# Altium schematic sheet USB_to_UART.SchDoc: USB_to_UART_and_Power_Supply
size 431 x 279 mm; Engineer: Will Mensah; Organization: ORGANIZATION; Address1: ADDRESS 1; Address2: ADDRESS 2; Address3: ADDRESS 3; Address4: ADDRESS 4; Revision: -; SheetNumber: 1; SheetTotal: 6; ENG_APP_DATE: --/--/--; DSN_APP_DATE: --/--/--; CHK_APP_DATE: --/--/--
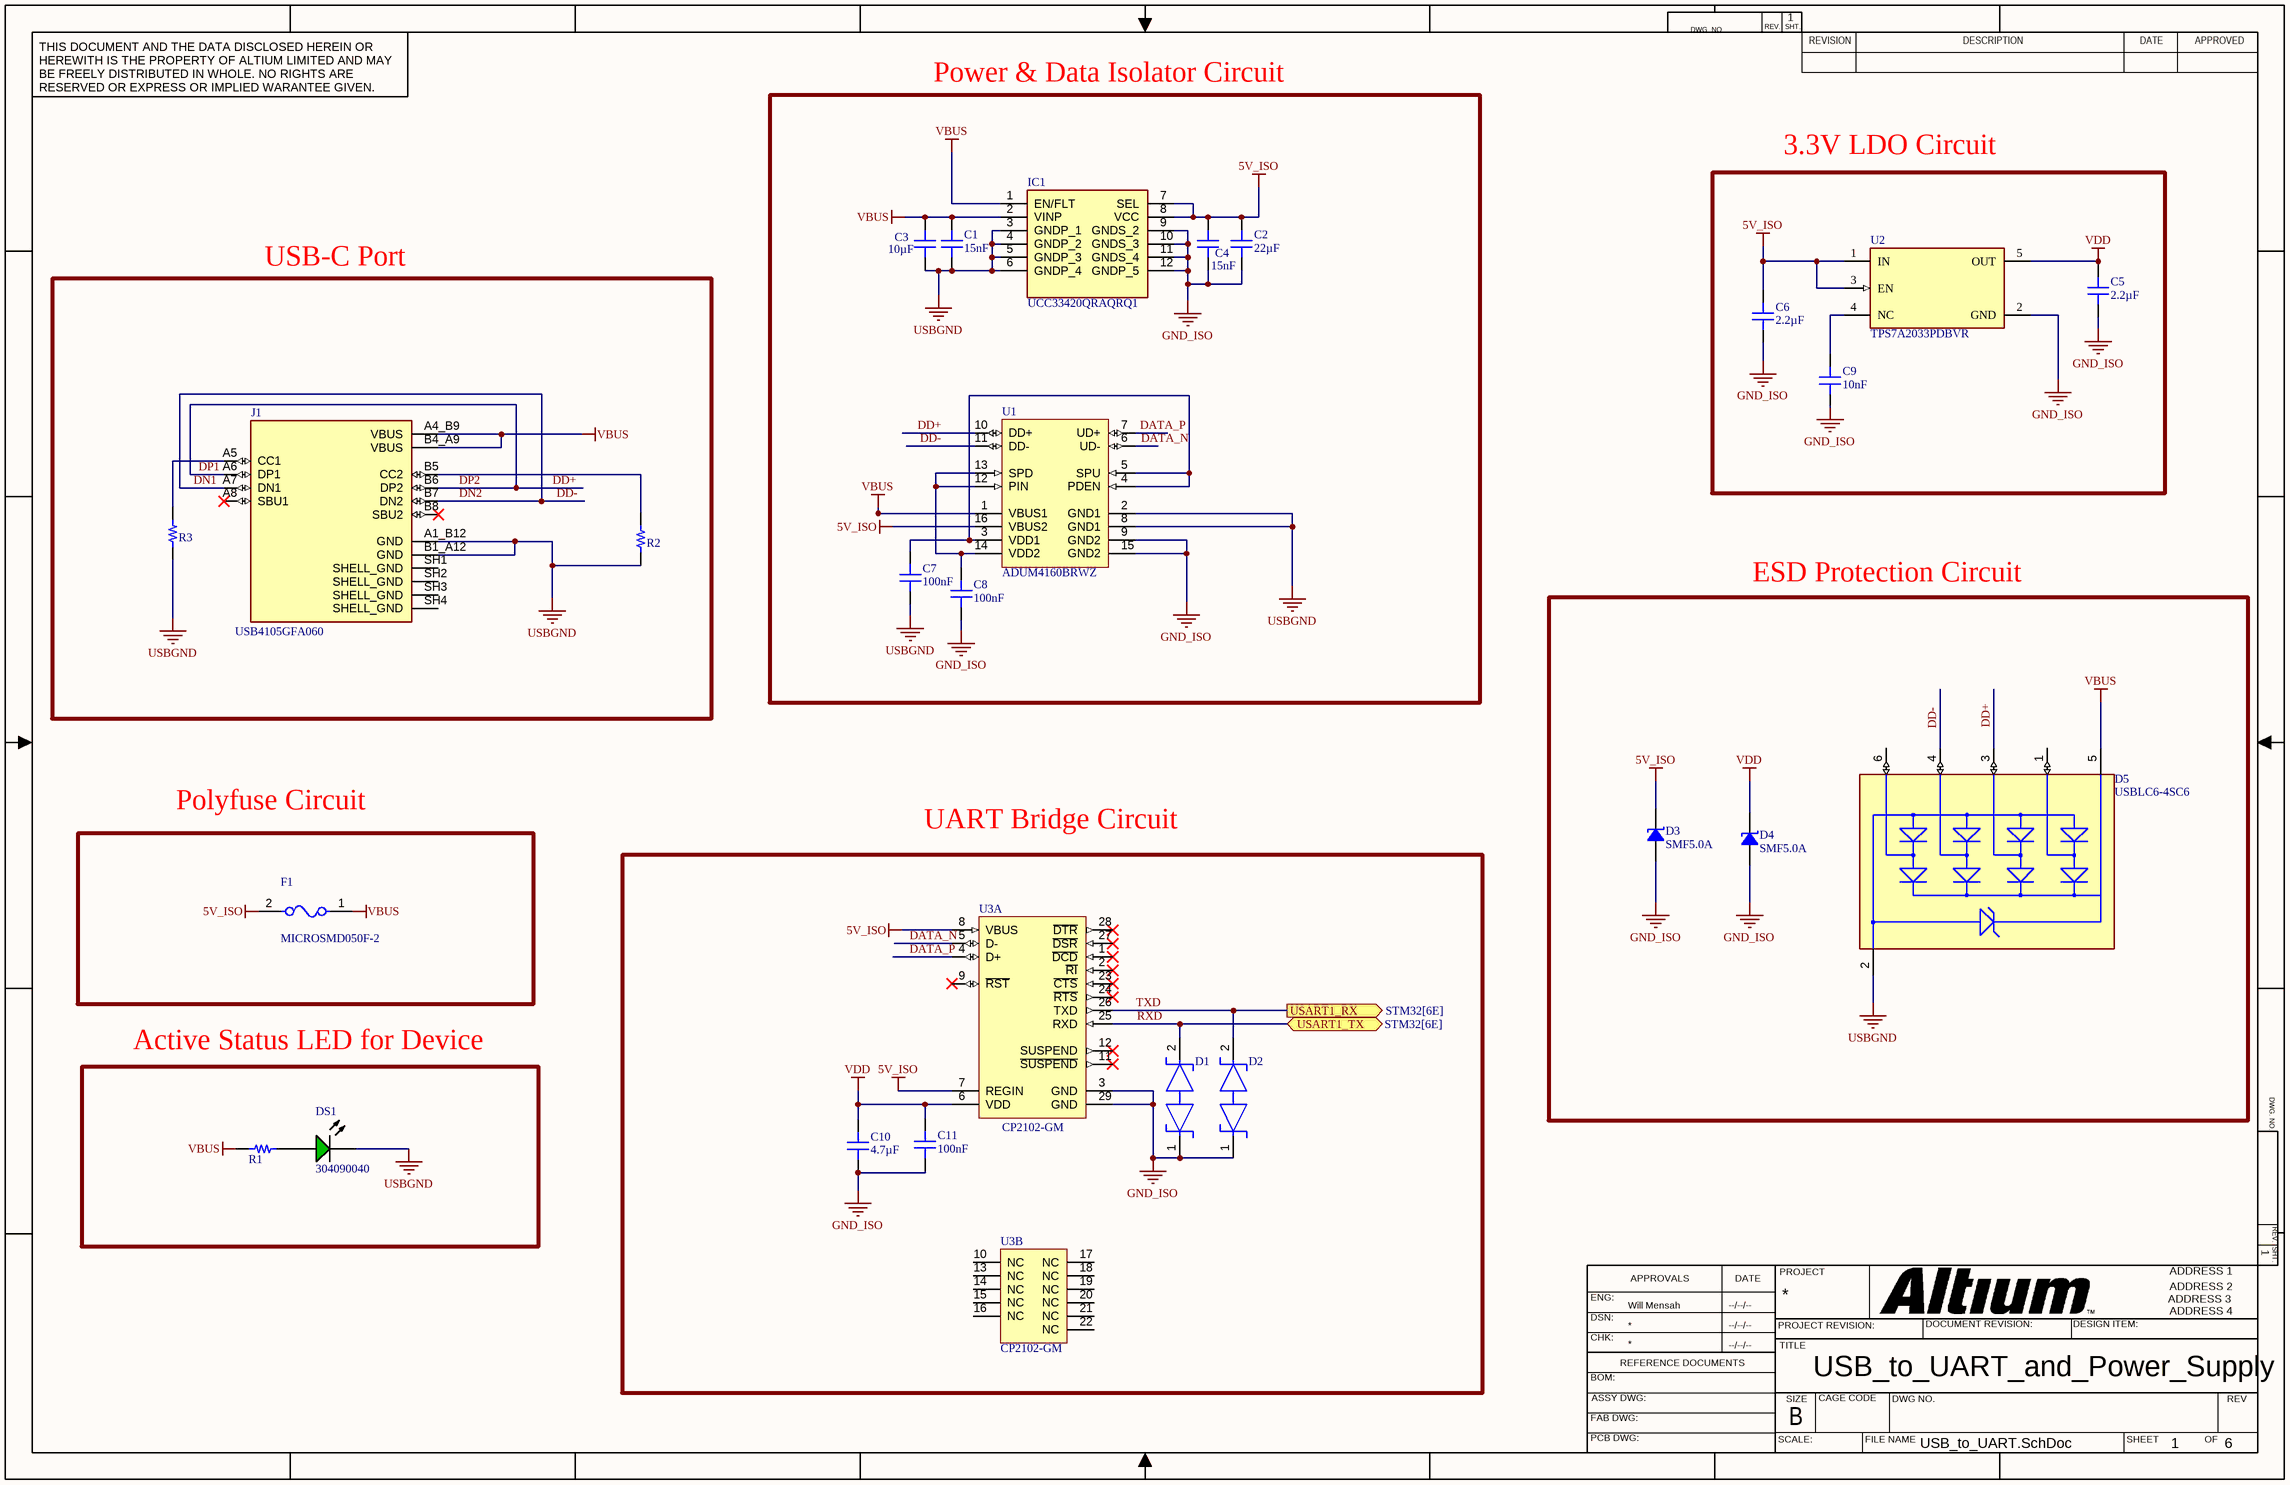
[diagram p0: USB_to_UART.SchDoc]

## Parts
C1  value 15nF  [CAP 1206_3216 - 0.8MM]  (hidden comment: 885342208013)
C2  value 22µF  [MURATA - GRM32E]  (hidden comment: GRM32ER71E226ME15L)
C3  value 10µF  [MURATA - GRM32E]  (hidden comment: GRM32ER71H106MA12L)
C4  value 15nF  [CAP 1206_3216 - 0.8MM]  (hidden comment: 885342208013)
C5  value 2.2µF  [MURATA CAP GCM31M 1206_3216]  (hidden comment: GCM31CL8EL225KE07L)
C6  value 2.2µF  [MURATA CAP GCM31M 1206_3216]  (hidden comment: GCM31CL8EL225KE07L)
C7  value 100nF  [MURATA CAP GCM31M 1206_3216]  (hidden comment: GCM31C5C1H104FA16L)
C8  value 100nF  [MURATA CAP GCM31M 1206_3216]  (hidden comment: GCM31C5C1H104FA16L)
C9  value 10nF  [MURATA CAP GRM31B 1206_3216]  (hidden comment: GRM31B7U2E103JW31L)
C10  value 4.7µF  [MURATA GRM21B 0805_2012]  (hidden comment: GRM21BR71A475KE51L)
C11  value 100nF  [MURATA CAP GCM31M 1206_3216]  (hidden comment: GCM31C5C1H104FA16L)
D1  TPD1E10B06DPYR  [FP-DPY0002A-MFG]  (value not drawn)
D2  TPD1E10B06DPYR  [FP-DPY0002A-MFG]  (value not drawn)
D3  SMF5.0A  [SOD123F]
D4  SMF5.0A  [SOD123F]
D5  USBLC6-4SC6  [FP-SOT23-6L-MFG]
DS1  304090040  [LED-2P-2.28-3MM]
F1  MICROSMD050F-2  [FP-microSMD-MFG]
IC1  UCC33420QRAQRQ1  [UCC33020QRAQRQ1]
J1  USB4105GFA060  [GCT_USB4105GFA060]
R1  RC1206FR-101KL  [YAGEO RES 1206_3216]  (value not drawn)
R2  RP1206BRD075K1L  [YAGEO RES 1206_3216]  (value not drawn)
R3  RP1206BRD075K1L  [YAGEO RES 1206_3216]  (value not drawn)
U1  ADUM4160BRWZ  [RW-16_L]
U2  TPS7A2033PDBVR  [FP-DBV0005A-MFG]
U3  CP2102-GM  [SLAB-QFN-28-3125x3125TP_N]  (parts A,B of 2)

## Blocks framed on the sheet
Power & Data Isolator Circuit: C1-C4 C7 C8 IC1 U1
3.3V LDO Circuit: C5 C6 C9 U2
USB-C Port: J1 R2 R3
ESD Protection Circuit: D3-D5
Polyfuse Circuit: F1
UART Bridge Circuit: C10 C11 D1 D2 U3
Active Status LED for Device: DS1 R1

## Ports
USART1_RX (out, see STM32[6E]), USART1_TX (bidir, see STM32[6E])

## Nets
5V_ISO: C2.2 C4.2 C6.2 D3.2 F1.2 IC1.7(SEL) IC1.8(VCC) U1.16(VBUS2) U2.1(IN) U2.3(EN) U3.7(REGIN) U3.8(VBUS)
GND_ISO: C2.1 C4.1 C5.1 C6.1 C8.1 C9.1 C10.1 C11.1 D1.1 D2.1 D3.1 D4.1 IC1.9(GNDS_2) IC1.10(GNDS_3) IC1.11(GNDS_4) IC1.12(GNDP_5) U1.9(GND2) U1.15(GND2) U2.2(GND) U3.3(GND) U3.29(GND)
USBGND: C1.1 C3.1 C7.1 D5.2(GND) DS1.2(K) IC1.3(GNDP_1) IC1.4(GNDP_2) IC1.5(GNDP_3) IC1.6(GNDP_4) J1.A1_B12(GND) J1.B1_A12(GND) R2.1 R3.2 U1.2(GND1) U1.8(GND1)
VBUS: C1.2 C3.2 D5.5(VBUS) F1.1 IC1.1(EN/FLT) IC1.2(VINP) J1.A4_B9(VBUS) J1.B4_A9(VBUS) R1.2 U1.1(VBUS1)
VDD: C5.2 C10.2 C11.2 D4.2 U2.5(OUT) U3.6(VDD)
DATA_N: U1.6(UD-) U3.5(D-)
DATA_P: U1.7(UD+) U3.4(D+)
DD+: D5.3(I/O2) J1.A6(DP1) J1.B6(DP2) U1.10(DD+)  [also labelled DP1, DP2]
DD-: D5.4(I/O3) J1.A7(DN1) J1.B7(DN2) U1.11(DD-)  [also labelled DN1, DN2]
RXD: D1.2 U3.25(RXD) ; port USART1_TX
TXD: D2.2 U3.26(TXD) ; port USART1_RX
NetC7_2: C7.2 U1.3(VDD1) U1.4(PDEN) U1.5(SPU)
NetC8_2: C8.2 U1.12(PIN) U1.13(SPD) U1.14(VDD2)
NetC9_2: C9.2 U2.4(NC)
NetDS1_1: DS1.1(A) R1.1
NetJ1_A5: J1.A5(CC1) R3.1
NetJ1_B5: J1.B5(CC2) R2.2

Not connected (* = marked no-connect by the designer): D5 1(I/O1) 6(I/O4); J1 A8(SBU1)* B8(SBU2)* SH1(SHELL_GND) SH2(SHELL_GND) SH3(SHELL_GND) SH4(SHELL_GND); U3 1(~{DCD})* 2(~{RI})* 9(~{RST})* 10(NC) 11(~{SUSPEND})* 12(SUSPEND)* 13(NC) 14(NC) 15(NC) 16(NC) 17(NC) 18(NC) 19(NC) 20(NC) 21(NC) 22(NC) 23(~{CTS})* 24(~{RTS})* 27(~{DSR})* 28(~{DTR})*

## Notes on the sheet
- DWG. NO.
- REV.
- SHT.
- THIS DOCUMENT AND THE DATA DISCLOSED HEREIN OR HEREWITH IS THE PROPERTY OF ALTIUM LIMITED AND MAY BE FREELY DISTRIBUTED IN WHOLE. NO RIGHTS ARE RESERVED OR EXPRESS OR IMPLIED WARANTEE GIVEN.
- REVISION
- DESCRIPTION
- DATE
- APPROVED
- ENG:
- APPROVALS
- PROJECT
- DSN:
- CHK:
- REFERENCE DOCUMENTS
- PROJECT REVISION:
- TITLE
- DOCUMENT REVISION:
- DESIGN ITEM:
- BOM:
- FAB DWG:
- PCB DWG:
- ASSY DWG:
- SCALE:
- SIZE
- B
- CAGE CODE
- FILE NAME
- DWG NO.
- SHEET
- OF
- REV

## Library data of the parts
C1 C4 = CMP-001-059796-1: CAP CER 15000PF 630V X7R 1206; Part Number: 885342208013
C2 = CMP-001-068110-1: CAP CER 22UF 25V X7R 1210; Part Number: GRM32ER71E226ME15L
C3 = CMP-001-068673-1: CAP CER 10UF 50V X7R 1210; Part Number: GRM32ER71H106MA12L
C5 C6 = CMP-001-063237-1: CAP CER 2.2UF 100V X8L 1206; Part Number: GCM31CL8EL225KE07L
C7 C8 C11 = CMP-001-060542-1: CAP CER 0.1UF 50V C0G/NP0 1206; Part Number: GCM31C5C1H104FA16L
C9 = CMP-001-062663-1: CAP CER 10000PF 250V U2J 1206; Part Number: GRM31B7U2E103JW31L
C10 = CMP-001-052117-1: CAP CER 4.7UF 10V X7R 0805; Part Number: GRM21BR71A475KE51L
D1 D2 = CMP-0326-00004-4: TVS DIODE 5.5V 14V 2X1SON; Manufacturer: Texas Instruments; Leakage Current: 100nA; Min Breakdown Voltage: 6V; Number of Channels: 1; ESD Protection: Yes; Power Line Protection: No; Test Current: 1mA; Interface: GPIO; Element Configuration: Single; Peak Pulse Current: 5A; Direction: Bidirectional; Peak Pulse Power: 90W; Capacitance: 12pF; Composition: Zener; Packaging: Tape and Reel; Number of Pins: 2; Breakdown Voltage: 6V; Radiation Hardening: No; Min Operating Temperature: -40°C; Contact Plating: Gold; Lead Free: Lead Free; Height: 0.35mm; REACH SVHC: No SVHC; Case/Package: 0402; Max Operating Temperature: 125°C; Width: 0.7mm; Clamping Voltage: 14V; Package Quantity: 1; Max Reverse Leakage Current: 100nA; Working Voltage: 5.5V; Length: 1.1mm; Number of Bidirectional Channels: 1; Reverse Standoff Voltage: 5.5V; PartNumber: TPD1E10B06DPYR
D3 D4 = CMP-004-19987-1: TVS SOD123FL 5V 200W UNIDIR; Part Number: SMF5.0A
D5 = CMP-2000-07370-2: TVS DIODE 5.25V 17V SOT23-6; Manufacturer: STMicroelectronics; Peak Pulse Power: 130W; Breakdown Voltage: 6V; Value: 3pF; Direction: Unidirectional; Interface: USB,Ethernet,Other; Number Of Channels: 4; Standoff Height: 0mm; Max Junction Temp: +125°C; Digikey Description: TVS DIODE 5.25V 17V SOT23-6; Automotive: No; Package: SOT23-6L; Mouser Description: USBLC6 Series 4 Line 6 V Uni / Bi-Directional ESD Protection - SOT-23-6; Octopart: https://octopart.com/usblc6-4sc6-stmicroelectronics-347147; RoHS: TRUE; ComponentLink2URL: https://upverter.com/datasheet/23dc4ffb028d868909e80577610284b194f13213.pdf; ComponentLink2Description: Datasheet; Device Class L1: Circuit Protection; Lead Free: Yes; Temperature Range High: +125°C; Device Class L2: ESD and Circuit Protection ICs; Device Class L3: unset; Capacitance: 3pF; Height: 1.45mm; Temperature Range Low: -40°C; Manufacturer Part Number: USBLC6-4SC6; Temperature: -40°C to +125°C; Category: Diode; Clamping Voltage: 17V
DS1 = CMP-007-00006-2: Green LED, 80 mW, 20 mA, -25 to 85 degC, 2-Pin THD; Manufacturer: Shenzhen CGX; Manufacturer URL: http://szcgx.com/; Package Reference: 304090040; Datasheet Version: Rev. 1.0, 09/2014; RoHS Compliant: Unknown; Case/Package: 304090040; Package Description: 2-Pin Through Hole Device, Dia 3 mm, Pitch 2.28 mm; Datasheet URL: http://datasheet.octopart.com/304090040-Chengguangxing-datasheet-62330655.pdf; Mounting Technology: TH
F1 = CMP-08606-000015-1: PTC RESET FUSE 13.2V 500MA 1210; Manufacturer: Littelfuse; Hold Current: 0.5A; Resistance: 0.25-0.9Ω; Trip Time: 0.05s; Value: 0.25-0.9Ω; Trip Current: 1A; Current Rating: 40A; Device Class L3: unset; ComponentLink2URL: https://www.littelfuse.com/~/media/electronics/datasheets/resettable_ptcs/littelfuse_ptc_microsmd_datasheet.pdf.pdf; Temperature: to +85°C; ComponentLink2Description: Datasheet; RoHS: TRUE; Category: Fuse; Ambient Temperature Range Low: -40°C; Lead Free: Yes; Device Class L1: Circuit Protection; Manufacturer Part Number: MICROSMD050F-2; Temperature Range High: +85°C; Ambient Temperature Range High: +85°C; Automotive: No; Height: 0.62mm; Digikey Description: PTC RESET FUSE 13.2V 500MA 1210; Voltage Rating: 13.2V; Package: microSMD; Octopart: https://octopart.com/microsmd050f-2-littelfuse-74214982; Device Class L2: PTC Resettable Fuses
IC1 = UCC33420QRAQRQ1: Integrated Circuit; Manufacturer_Name: Texas Instruments; Datasheet Link: https://www.ti.com/lit/ds/symlink/ucc33420-q1.pdf?ts=1741595347894&ref_url=https%253A%252F%252Fwww.ti.com%252Fproduct%252FUCC33420-Q1; Height: 1.05mm; Manufacturer_Part_Number: UCC33420QRAQRQ1; Mouser Part Number: 595-UCC33420QRAQRQ1; Mouser Price/Stock: https://www.mouser.co.uk/ProductDetail/Texas-Instruments/UCC33420QRAQRQ1?qs=7%2F6SraaimPSitAwgIt4uJA%3D%3D; Arrow Part Number: UCC33420QRAQRQ1; Arrow Price/Stock: https://www.arrow.com/en/products/ucc33420qraqrq1/texas-instruments?utm_currency=USD&region=nac
J1 = CMP-002-00267-1: USB-C (USB TYPE-C) USB 2.0 Receptacle Connector 24 (16+8 Dummy) Position Surface Mount, Right Angle; Through Hole; MF: Global Connector Technology; Check_prices: https://www.snapeda.com/parts/USB4105GFA060/Global+Connector+Technology/view-part/?ref=eda; Component Type: Standard; Source: USB4105GFA060.SchLib; SnapEDA_Link: https://www.snapeda.com/parts/USB4105GFA060/Global+Connector+Technology/view-part/?ref=snap; Pins: 16; Case/Package: None; Design Item ID: USB4105GFA060; Value: *; MP: USB4105GFA060
R1 = CMP-009-085524-1: RES 1K OHM 1% 1/4W 1206; Part Number: RC1206FR-101KL
R2 R3 = CMP-009-086345-1: RES 5.1K OHM 0.1% 1/4W 1206; Part Number: RP1206BRD075K1L
U1 = CMP-0534-00647-1: Full/Low Speed USB Digital Isolator, 2 Channels, 5 kV rms, 3.1 to 5.5 V, -40 to 105 degC, 16-Pin SOIC (RW-16), RoHS, Tube; Manufacturer: Analog Devices; IDD@12 Mbps: 8 mA Max.; Number of Channels: 2; Data Rate: 12 Mbps Max.; CIN: 10 pF Typ.; Voltage Isolation: 5 kVrms; DatasheetVersion: Rev. D; VBUS: 3.1 to 5.5 V; PartNumber: ADUM4160BRWZ; Temperature Range: -40 to 105 degC; Mounting Technology: Surface Mount; PackageDescription: 16-Pin Small Outline Integrated Circuit, Body 10.3 x 7.5 mm, Pitch 1.27 mm; ComponentLink2URL: http://www.analog.com/static/imported-files/data_sheets/ADuM4160.pdf; PackageVersion: Mar-07; ComponentLink2Description: Datasheet; ComponentLink1URL: http://www.analog.com/en/index.html; Packing: Tube; ComponentLink3URL: http://www.analog.com/static/imported-files/packages/PKG_PDF/SOIC_WIDE%20(RW)/RW_16.pdf; RoHS: TRUE; ComponentLink3Description: Package Specification; ComponentLink1Description: Manufacturer URL
U2 = CMP-04917-000300-1: IC REG LINEAR 3.3V 300MA SOT23-5; RoHS Compliant: Yes
U3 = CMP-0511-00012-1: Single-Chip USB to UART Bridge, 1024 Bytes EEPROM, -40 to 85 degC, 28-pin QFN, Tube; Manufacturer: Silicon Labs; Internal Oscillator: TRUE; Sub-Family: USB Bridges; ComponentLink3Description: Package Specification; PackageDescription: 28-Pin Quad-Flat No-Leads Package, Body 5 x 5 mm, Pitch 0.5 mm; PartNumber: CP2102-GM; EEPROM: 1024 Bytes; Mounting Technology: Surface Mount; ComponentLink2URL: http://www.silabs.com/Support%20Documents/TechnicalDocs/CP2102-9.pdf; DatasheetVersion: Rev. 1.5; ComponentLink1URL: http://www.silabs.com/; ComponentLink2Description: Datasheet; Code_JEDEC: MO-220; PackageReference: QFN-28; Code_IPC: J-STD-020C; ComponentLink3URL: http://www.silabs.com/Support%20Documents/TechnicalDocs/C8051T61x.pdf; ComponentLink1Description: Manufacturer URL